# EAGLE design ledcircuit (EAGLE 6.4)
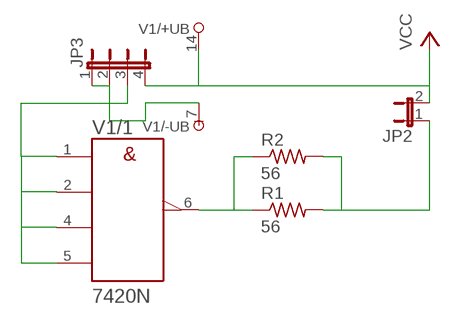
[diagram p0: schematic, sheet 1]

## Parts
JP2  JP1E  [JP1]
JP3  JP4E  [JP4]
R1  56  R-US_0207/10  [0207/10]
R2  56  R-US_0207/10  [0207/10]
V1  7420N  [DIL14]

## Nets
N$1: R1.1 R2.1 V1.6(/1:Y)
N$2: JP2.1 R1.2 R2.2
N$3: JP3.3 V1.1(/1:A) V1.2(/1:B) V1.4(/1:C) V1.5(/1:D)
N$4: JP3.1 JP3.2 V1.7(/-UB:-UB)
VCC: JP2.2 JP3.4 V1.14(/+UB:+UB)
Unconnected: V1.8(/2:Y) V1.9(/2:A) V1.10(/2:B) V1.12(/2:C) V1.13(/2:D)

## Library data of the parts
JP2 = jumper:JP1E: JUMPER
JP3 = jumper:JP4E: JUMPER
R1 R2 = resistor:R-US_: RESISTOR, American symbol
V1 = 74ttl-din:74*20: Dual 4-input NAND gate

## Board
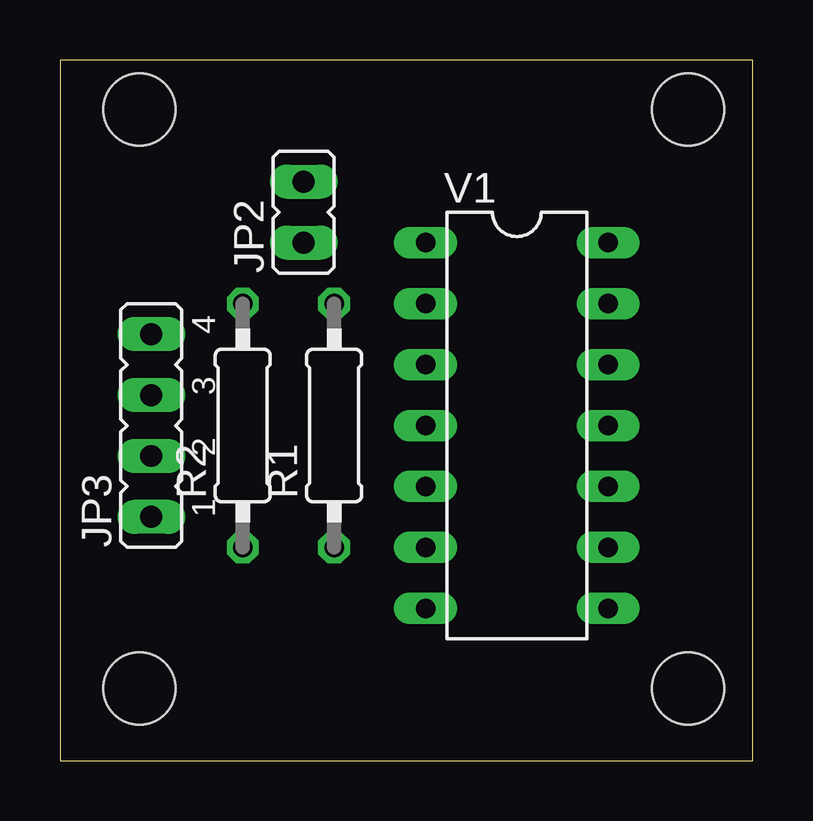
[diagram p1: board, top side]
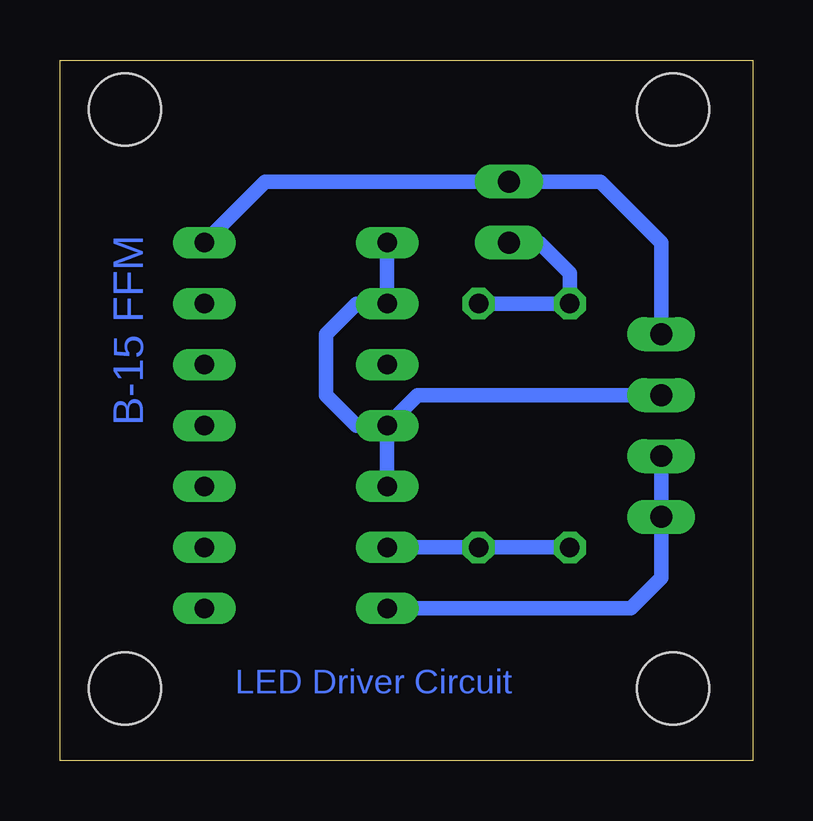
[diagram p2: board, bottom side, seen from below]

Size 28.88 x 29.2 mm. Coordinates in mm from the lower left corner, seen from the top.
Outline: 0,0 28.88,0 28.88,29.2 0,29.2 0,0
Copper layers (1*16): Top 0.035mm / dielectric 1.5mm / Bottom 0.035mm
Design rules "default *": minimum track width 16mil, minimum drill 30mil, track to track 16mil, track to pad 16mil, pad to pad 16mil, via to via 16mil, smd to smd 16mil, copper to edge 40mil, drill to drill 8mil, minimum pad ring 10mil, minimum via ring 8mil, stop-mask expansion 4mil, vias tented up to drill 0mil, thermal gap 10mil
Holes 3 mm at 26.18,3.01 3.32,3.01 3.32,27.14 26.18,27.14

### Footprints (pad centres in the part's own frame; a part is rotated, then mirrored left to right if it is on the bottom)
JP1 = drill 0.914 long: 1 0,-1.27; 2 0,1.27
JP4 = drill 0.914 long: 1 -3.81,0; 2 -1.27,0; 3 1.27,0; 4 3.81,0
0207/10 = drill 0.813 octagon: 1 -5.08,0; 2 5.08,0
DIL14 = drill 0.813 long: 1 -7.62,-3.81; 2 -5.08,-3.81; 3 -2.54,-3.81; 4 0,-3.81; 5 2.54,-3.81; 6 5.08,-3.81; 7 7.62,-3.81; 8 7.62,3.81; 9 5.08,3.81; 10 2.54,3.81; 11 0,3.81; 12 -2.54,3.81; 13 -5.08,3.81; 14 -7.62,3.81

### Placement (x,y rotation side)
JP2  10.16,22.86 0 top
JP3  3.81,13.97 90 top
R1  11.43,13.97 90 top
R2  7.62,13.97 90 top
V1  19.05,13.97 270 top

### Tracks (layer width: path | path; a pad name or v marks a point on that pad's centre or on a via)
N$1
  Bottom 0.61: R2.1 R1.1 V1.6
N$2
  Bottom 0.61: R1.2 R2.2 7.62,20.32 8.89,21.59 JP2.1
N$3
  Bottom 0.61: V1.1 V1.2 16.51,19.05 17.78,17.78 17.78,15.24 16.51,13.97 V1.4 | V1.5 V1.4 | JP3.3 13.97,15.24 V1.4
N$4
  Bottom 0.61: JP3.2 JP3.1 3.81,7.62 5.08,6.35 V1.7
VCC
  Bottom 0.61: JP3.4 3.81,21.59 6.35,24.13 JP2.2 20.32,24.13 V1.14

### Text on the board
Bottom: B-15 FFM | LED Driver Circuit